# EAGLE design WicinskiPI (EAGLE 7.7.0)
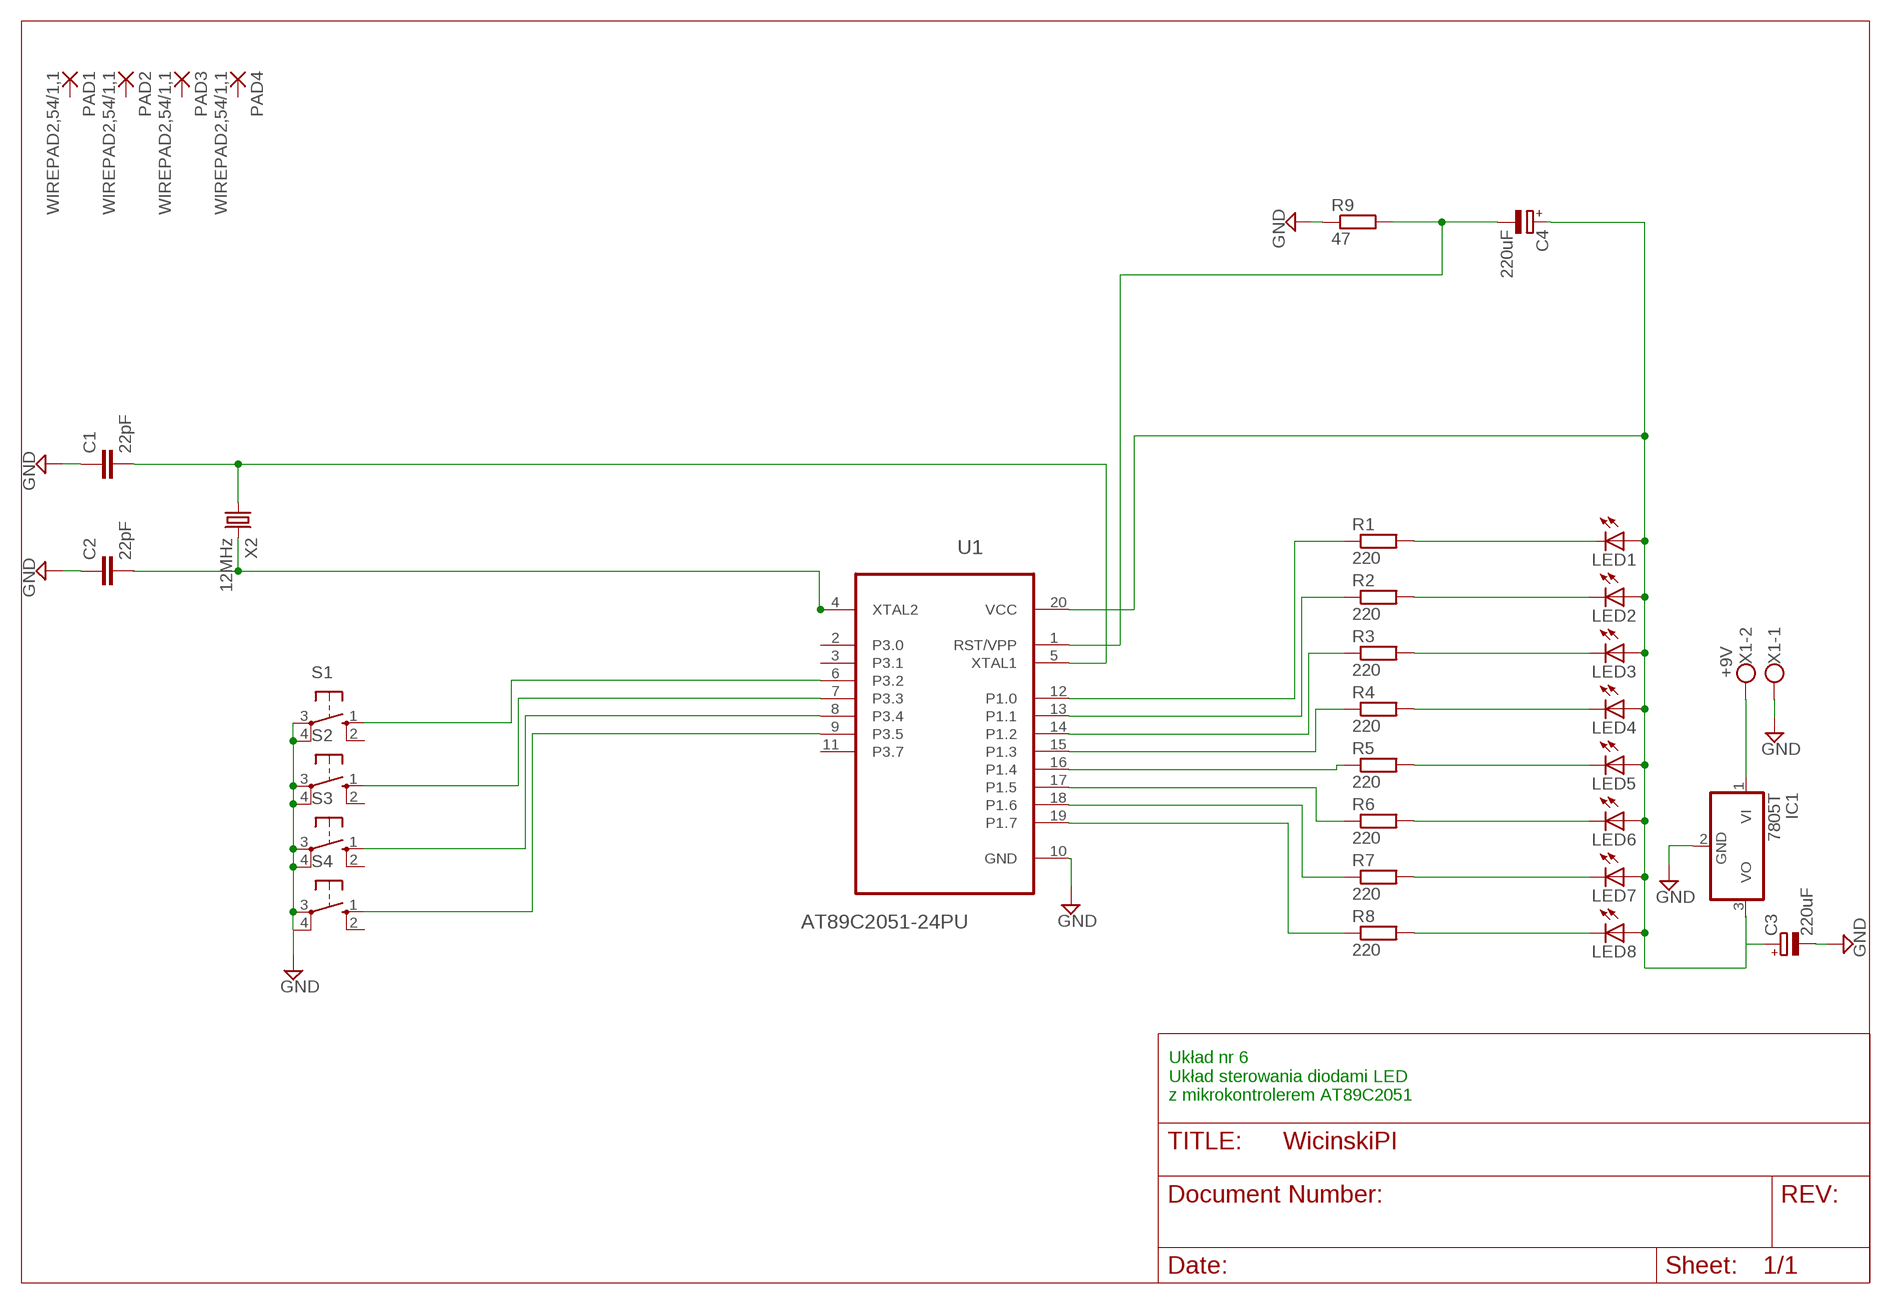
[diagram p0: schematic, sheet 1]

## Parts
C1  22pF  C-EUC1206  [C1206]
C2  22pF  C-EUC1206  [C1206]
C3  220uF  CPOL-EUE3.5-8  [E3,5-8]
C4  220uF  CPOL-EUE3.5-8  [E3,5-8]
IC1  7805T  [TO220H]
LED1  LED3MM  [LED3MM]
LED2  LED3MM  [LED3MM]
LED3  LED3MM  [LED3MM]
LED4  LED3MM  [LED3MM]
LED5  LED3MM  [LED3MM]
LED6  LED3MM  [LED3MM]
LED7  LED3MM  [LED3MM]
LED8  LED3MM  [LED3MM]
PAD1  WIREPAD2,54/1,1  [2,54/1,1]
PAD2  WIREPAD2,54/1,1  [2,54/1,1]
PAD3  WIREPAD2,54/1,1  [2,54/1,1]
PAD4  WIREPAD2,54/1,1  [2,54/1,1]
R1  220  R-EU_R2012  [R2012]
R2  220  R-EU_R2012  [R2012]
R3  220  R-EU_R2012  [R2012]
R4  220  R-EU_R2012  [R2012]
R5  220  R-EU_R2012  [R2012]
R6  220  R-EU_R2012  [R2012]
R7  220  R-EU_R2012  [R2012]
R8  220  R-EU_R2012  [R2012]
R9  47  R-EU_R2012  [R2012]
S1  10-XX  [B3F-10XX]
S2  10-XX  [B3F-10XX]
S3  10-XX  [B3F-10XX]
S4  10-XX  [B3F-10XX]
U1  AT89C2051-24PU  [DIP254P762X533-20]
X1  +9V  W237-102  [W237-102]
X2  12MHz  CRYSTALS-NOGND-HC49  [HC49]

## Nets
GND: C1.1 C2.1 C3.- IC1.2(GND) R9.1 S1.3(P) S1.4(P1) S2.3(P) S2.4(P1) S3.3(P) S3.4(P1) S4.3(P) S4.4(P1) U1.10(GND) X1.1
N$1: LED8.K(C) R8.2
N$2: LED7.K(C) R7.2
N$3: LED6.K(C) R6.2
N$4: LED5.K(C) R5.2
N$5: LED4.K(C) R4.2
N$6: LED3.K(C) R3.2
N$7: LED2.K(C) R2.2
N$8: LED1.K(C) R1.2
N$9: R1.1 U1.12(P1.0)
N$10: R2.1 U1.13(P1.1)
N$11: R3.1 U1.14(P1.2)
N$12: R4.1 U1.15(P1.3)
N$13: R5.1 U1.16(P1.4)
N$14: R6.1 U1.17(P1.5)
N$15: R7.1 U1.18(P1.6)
N$16: R8.1 U1.19(P1.7)
N$22: S1.1(S) U1.6(P3.2)
N$23: S2.1(S) U1.7(P3.3)
N$24: S3.1(S) U1.8(P3.4)
N$25: S4.1(S) U1.9(P3.5)
N$26: C1.2 U1.5(XTAL1) X2.1
N$27: C4.- R9.2 U1.1(RST/VPP)
N$28: C2.2 U1.4(XTAL2) X2.2
N$30: IC1.1(VI) X1.2
N$32: C3.+ C4.+ IC1.3(VO) LED1.A LED2.A LED3.A LED4.A LED5.A LED6.A LED7.A LED8.A U1.20(VCC)
Unconnected: PAD1.1(P) PAD2.1(P) PAD3.1(P) PAD4.1(P) S1.2(S1) S2.2(S1) S3.2(S1) S4.2(S1) U1.2(P3.0) U1.3(P3.1) U1.11(P3.7)

## Notes on the sheet
- Układ nr 6
  Układ sterowania diodami LED
  z mikrokontrolerem AT89C2051

## Library data of the parts
C1 C2 = rcl:C-EU: CAPACITOR, European symbol
C3 C4 = rcl:CPOL-EU: POLARIZED CAPACITOR, European symbol
IC1 = linear:78*: Positive VOLTAGE REGULATOR Source: http://cache.national.com/ds/LM/LM78L05.pdf http://www.fairchildsemi.com/ds/LM/LM7805.pdf
LED1-LED8 = led:LED: LED OSRAM: - CHIPLED LG R971, LG N971, LY N971, LG Q971, LY Q971, LO R971, LY R971 LH N974, LH R974 LS Q976, LO Q976, LY Q976 LO Q996 - Hyper CHIPLED LW Q18S LB Q993, LB Q99A, LB R99A - SideLED LS A670, LO A670, LY A670, LG A670, LP A670 LB A673, LV A673, LT A673, LW A673 LH A674 LY A675 LS A676, LA A676, LO A676, LY A676, LW A676 LS A679, LY A679, LG A679 - Hyper Micro SIDELED® LS Y876, LA Y876, LO Y876, LY Y876 LT Y87S - SmartLED LW L88C, LW L88S LB L89C, LB L89S, LG L890 LS L89K, LO L89K, LY L89K LS L896, LA L896, LO L896, LY L896 - TOPLED LS T670, LO T670, LY T670, LG T670, LP T670 LSG T670, LSP T670, LSY T670, LOP T670, LYG T670 LG T671, LOG T671, LSG T671 LB T673, LV T673, LT T673, LW T673 LH T674 LS T676, LA T676, LO T676, LY T676, LB T676, LH T676, LSB T676, LW T676 LB T67C, LV T67C, LT T67C, LS T67K, LO T67K, LY T67K, LW E67C LS E67B, LA E67B, LO E67B, LY E67B, LB E67C, LV E67C, LT E67C LW T67C LS T679, LY T679, LG T679 LS T770, LO T770, LY T770, LG T770, LP T770 LB T773, LV T773, LT T773, LW T773 LH T774 LS E675, LA E675, LY E675, LS T675 LS T776, LA T776, LO T776, LY T776, LB T776 LHGB T686 LT T68C, LB T68C - Hyper Mini TOPLED® LB M676 - Mini TOPLED Santana® LG M470 LS M47K, LO M47K, LY M47K Source: http://www.osram.convergy.de LUXEON: - LUMILED® LXK2-PW12-R00, LXK2-PW12-S00, LXK2-PW14-U00, LXK2-PW14-V00 LXK2-PM12-R00, LXK2-PM12-S00, LXK2-PM14-U00 LXK2-PE12-Q00, LXK2-PE12-R00, LXK2-PE12-S00, LXK2-PE14-T00, LXK2-PE14-U00 LXK2-PB12-K00, LXK2-PB12-L00, LXK2-PB12-M00, LXK2-PB14-N00, LXK2-PB14-P00, LXK2-PB14-Q00 LXK2-PR12-L00, LXK2-PR12-M00, LXK2-PR14-Q00, LXK2-PR14-R00 LXK2-PD12-Q00, LXK2-PD12-R00, LXK2-PD12-S00 LXK2-PH12-R00, LXK2-PH12-S00 LXK2-PL12-P00, LXK2-PL12-Q00, LXK2-PL12-R00 Source: www.luxeon.com KINGBRIGHT: KA-3528ASYC Source: www.kingbright.com
PAD1-PAD4 = wirepad:WIREPAD: Wire PAD connect wire on PCB
R1-R9 = rcl:R-EU_: RESISTOR, European symbol
S1-S4 = switch-omron:10-XX: OMRON SWITCH; MPN: B3F-1000; OC_FARNELL: 176432; OC_NEWARK: 36M3542
U1 = AT89C2051-24PU:AT89C2051-24PU: Check availability <https://pricing.snapeda.com/parts/AT89C2051-24PU/Microchip/view-part?ref=eda>; AVAILABILITY: In Stock; CHECK_PRICES: https://www.snapeda.com/parts/AT89C2051-24PU/Microchip+Technology/view-part/?ref=eda; DESCRIPTION: 8051 series Microcontroller IC 8-Bit 24MHz 2KB (2K x 8) FLASH 20-PDIP; MF: Microchip; MP: AT89C2051-24PU; PACKAGE: DIP-20 Atmel; PRICE: None; PURCHASE-URL: https://www.snapeda.com/api/url_track_click_mouser/?unipart_id=46499&manufacturer=Microchip&part_name=AT89C2051-24PU&search_term=at89c2051; SNAPEDA_LINK: https://www.snapeda.com/parts/AT89C2051-24PU/Microchip+Technology/view-part/?ref=snap
X1 = con-wago-500:W237-102: WAGO SCREW CLAMP; MPN: 237-102; OC_FARNELL: unknown; OC_NEWARK: 70K9898
X2 = IQD-Frequency-Products:CRYSTALS-NOGND: CRYSTALS CAN NOT GROUNDED

## Board
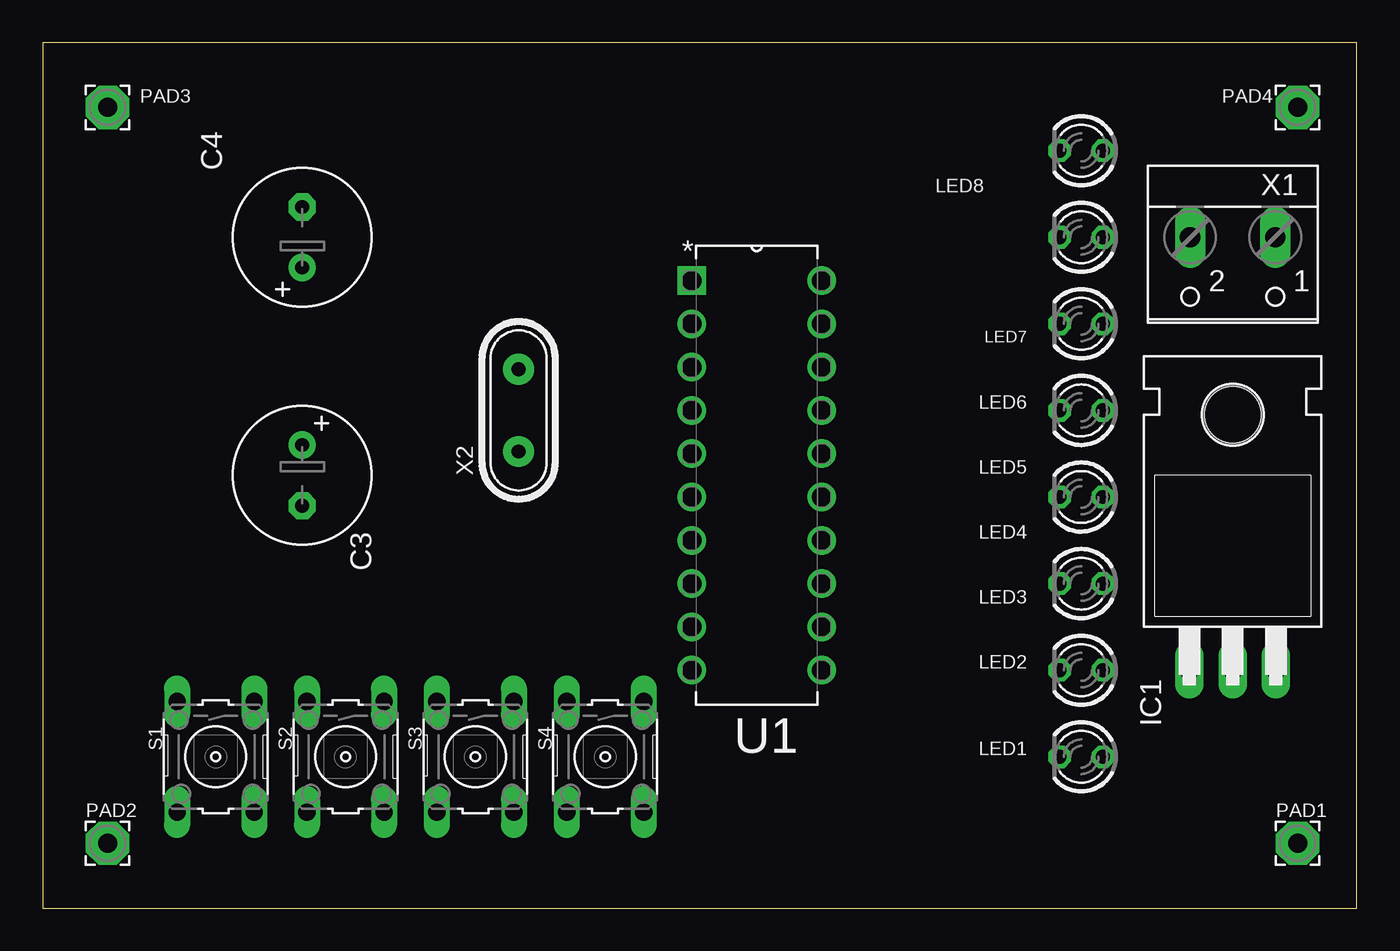
[diagram p1: board, top side]
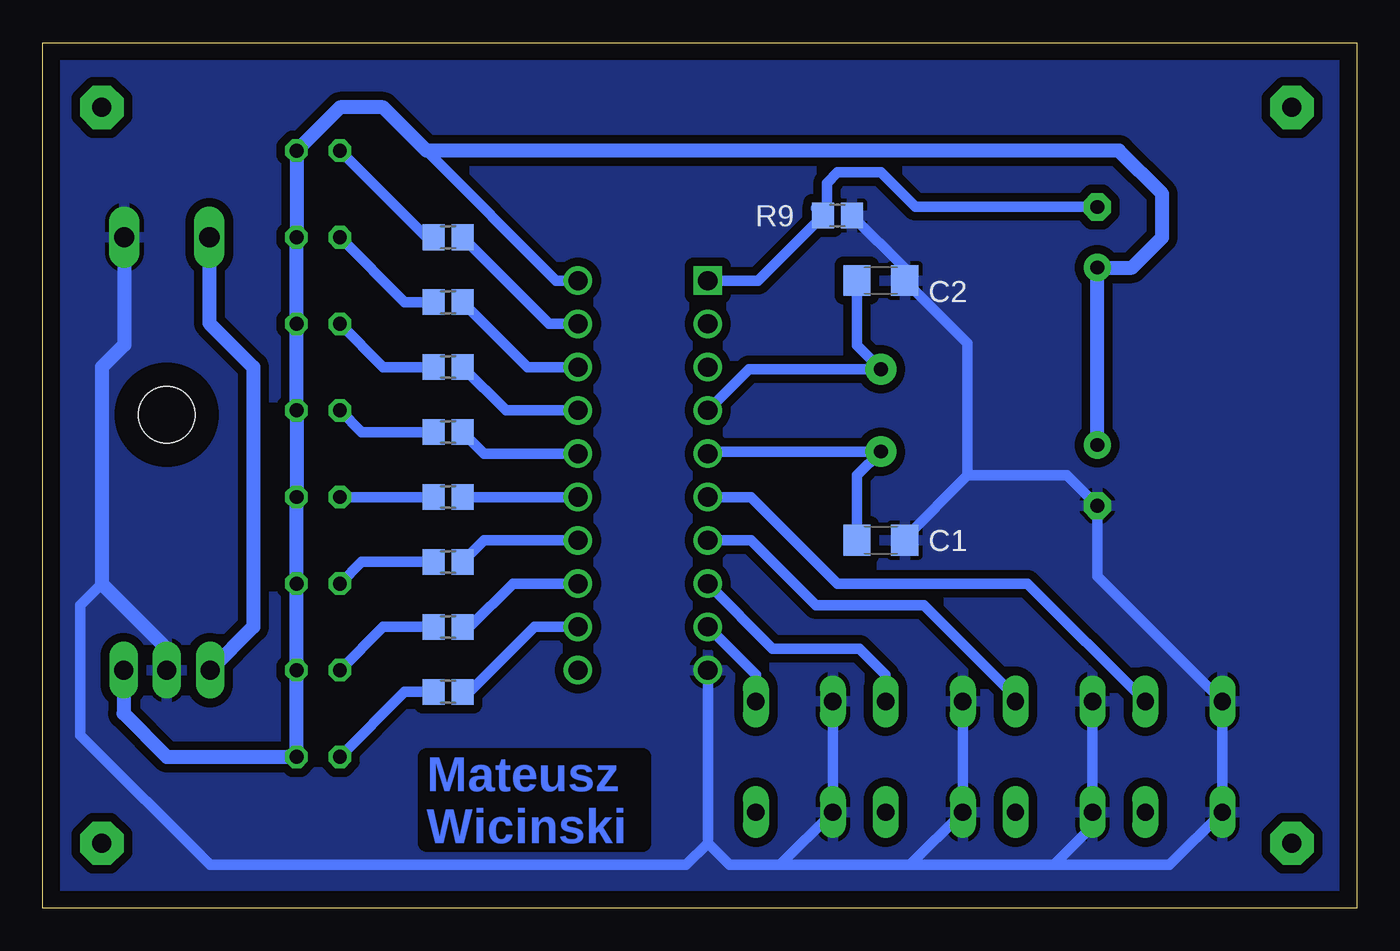
[diagram p2: board, bottom side, seen from below]

Size 77.14 x 50.79 mm. Coordinates in mm from the lower left corner, seen from the top.
Outline: 0,0 77.14,0 77.14,50.79 0,50.79 0,0
Copper layers (1*16): Top 0.035mm / dielectric 1.5mm / Bottom 0.035mm
Design rules "default": minimum track width 10mil, minimum drill 24mil, track to track 8mil, track to pad 8mil, pad to pad 8mil, via to via 8mil, smd to smd 8mil, copper to edge 40mil, drill to drill 8mil, minimum pad ring 10mil, minimum via ring 8mil, stop-mask expansion 4mil, vias tented up to drill 0mil, thermal gap 10mil

### Footprints (pad centres in the part's own frame; a part is rotated, then mirrored left to right if it is on the bottom)
C1206 = smd 1.6 x 1.8: 1 -1.4,0; 2 1.4,0
E3,5-8 = drill 0.813 pad 1.6: + -1.778,0 | drill 0.813 pad 1.6 octagon: - 1.778,0
TO220H = drill 1.118 long: 1 -2.54,-10.16; 2 0,-10.16; 3 2.54,-10.16 | hole 3.302: 0,4.826
LED3MM = drill 0.813 octagon: A -1.27,0; K 1.27,0
2,54/1,1 = drill 1.118 pad 2.54 octagon: 1 0,0
R2012 = smd 1.3 x 1.5: 1 -0.85,0; 2 0.85,0
B3F-10XX = drill 1.016 long: 1 -3.251,2.261; 2 3.251,2.261; 3 -3.251,-2.261; 4 3.251,-2.261
DIP254P762X533-20 = drill 1.118 square: 1 -7.62,22.86 | drill 1.118: 2 -7.62,20.32; 3 -7.62,17.78; 4 -7.62,15.24; 5 -7.62,12.7; 6 -7.62,10.16; 7 -7.62,7.62; 8 -7.62,5.08; 9 -7.62,2.54; 10 -7.62,0; 11 0,0; 12 0,2.54; 13 0,5.08; 14 0,7.62; 15 0,10.16; 16 0,12.7; 17 0,15.24; 18 0,17.78; 19 0,20.32; 20 0,22.86
W237-102 = drill 1.194 long: 1 -2.5,-1.27; 2 2.5,-1.27
HC49 = drill 0.813 pad 1.8: 1 -2.413,0; 2 2.413,0

### Placement (x,y rotation side)
C1  27.94,21.59 180 bottom
C2  27.94,36.83 180 bottom
C3  15.24,25.4 270 top
C4  15.24,39.37 90 top
IC1  69.85,24.13 0 top
LED1  60.96,8.89 180 top
LED2  60.96,13.97 180 top
LED3  60.96,19.05 180 top
LED4  60.96,24.13 180 top
LED5  60.96,29.21 180 top
LED6  60.96,34.29 180 top
LED7  60.96,39.37 180 top
LED8  60.96,44.45 180 top
PAD1  73.66,3.81 0 top
PAD2  3.81,3.81 0 top
PAD3  3.81,46.99 0 top
PAD4  73.66,46.99 0 top
R1  53.34,12.7 180 bottom
R2  53.34,16.51 180 bottom
R3  53.34,20.32 180 bottom
R4  53.34,24.13 180 bottom
R5  53.34,27.94 180 bottom
R6  53.34,31.75 180 bottom
R7  53.34,35.56 180 bottom
R8  53.34,39.37 180 bottom
R9  30.48,40.64 180 bottom
S1  10.16,8.89 270 top
S2  17.78,8.89 270 top
S3  25.4,8.89 270 top
S4  33.02,8.89 270 top
U1  45.72,13.97 0 top
X1  69.85,38.1 180 top
X2  27.94,29.21 90 top

### Tracks (layer width: path | path; a pad name or v marks a point on that pad's centre or on a via)
GND
  Bottom 0.61: R9.1 26.54,37.55 C2.1 22.86,33.15 22.86,25.4 | S4.3 S4.4 33.86,2.54 | S2.4 S2.3 15.52,4.8 17.78,2.54 | S3.3 S3.4 26.24,2.54 | C1.1 26.54,21.72 22.86,25.4 | 69.85,15.24 IC1.2 | 33.86,2.54 36.83,2.54 38.1,3.81 | 33.86,2.54 26.24,2.54 | 17.78,2.54 26.24,2.54 | U1.10 38.1,3.81 | 38.1,3.81 39.37,2.54 67.31,2.54 74.93,10.16 74.93,17.78 73.66,19.05 | 22.86,25.4 17.02,25.4 C3.- 15.24,19.48 S1.3 S1.4 11,2.54 17.78,2.54
  Bottom 0.813: X1.1 72.35,33.06 73.66,31.75 73.66,19.05 69.85,15.24
  pour Bottom (isolate 0.508): 0,0 0,50.8 77.47,50.8 77.47,49.53 77.47,0
N$1
  Bottom 0.61: R8.2 54.61,39.37 LED8.K
N$2
  Bottom 0.61: R7.2 55.88,35.56 LED7.K
N$3
  Bottom 0.61: R6.2 57.15,31.75 LED6.K
N$4
  Bottom 0.61: R5.2 58.42,27.94 LED5.K
N$5
  Bottom 0.61: R4.2 LED4.K
N$6
  Bottom 0.61: R3.2 58.42,20.32 LED3.K
N$7
  Bottom 0.61: R2.2 57.15,16.51 LED2.K
N$8
  Bottom 0.61: R1.2 55.88,12.7 LED1.K
N$9
  Bottom 0.406: 52.07,12.7 R1.1
  Bottom 0.61: U1.12 48.26,16.51 52.07,12.7
N$10
  Bottom 0.406: 52.07,16.51 R2.1
  Bottom 0.61: U1.13 49.53,19.05 52.07,16.51
N$11
  Bottom 0.61: U1.14 51.22,21.59 R3.1
N$12
  Bottom 0.61: U1.15 R4.1
N$13
  Bottom 0.61: U1.16 51.22,26.67 R5.1
N$14
  Bottom 0.61: U1.17 49.95,29.21 R6.1
N$15
  Bottom 0.61: U1.18 48.68,31.75 R7.1
N$16
  Bottom 0.61: U1.19 47.41,34.29 R8.1
N$22
  Bottom 0.61: S1.1 19.33,19.05 30.48,19.05 35.56,24.13 U1.6
N$23
  Bottom 0.61: S2.1 20.04,12.42 25.4,17.78 31.75,17.78 35.56,21.59 U1.7
N$24
  Bottom 0.61: S3.1 27.66,13.69 29.21,15.24 34.29,15.24 U1.8
N$25
  Bottom 0.61: S4.1 35.28,13.69 U1.9
N$26
  Bottom 0.61: U1.5 37.97,26.8 X2.1 29.34,25.4 C1.2
N$27
  Bottom 0.61: U1.1 35.14,36.83 R9.2 | C4.- 25.91,41.15 27.94,43.18 30.48,43.18 31.11,42.55 31.11,40.86 R9.2 | 31.75,41.06 R9.2
N$28
  Bottom 0.61: C2.2 29.34,33.02 X2.2 35.69,31.62 U1.4
N$30
  Bottom 0.813: X1.2 67.35,34.33 64.77,31.75 64.77,16.51 IC1.1
N$32
  Bottom 0.61: U1.20 46.99,36.83 54.61,44.45
  Bottom 0.813: C3.+ C4.+ 13.21,37.59 11.43,39.37 11.43,41.91 13.97,44.45 54.61,44.45 57.15,46.99 59.69,46.99 LED8.A LED7.A LED6.A LED5.A LED4.A LED3.A LED2.A LED1.A 69.85,8.89 72.39,11.43 IC1.3

### Text on the board
Bottom: Mateusz / Wicinski